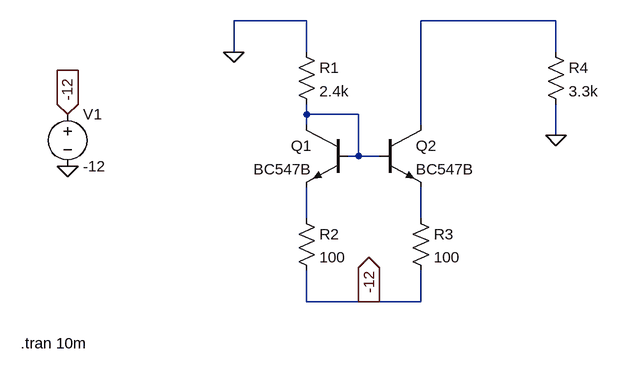
[diagram p0: schematic lab6.1.1a.asc]
lab6.1.1a.asc, the LTspice schematic file:
Version 4
SHEET 1 5668 680
WIRE 112 0 0 0
WIRE 496 0 288 0
WIRE 0 48 0 0
WIRE 112 48 112 0
WIRE 496 48 496 0
WIRE 112 144 112 128
WIRE 192 144 112 144
WIRE 112 160 112 144
WIRE 288 160 288 0
WIRE 496 176 496 128
WIRE 192 208 192 144
WIRE 192 208 176 208
WIRE 224 208 192 208
WIRE 112 304 112 256
WIRE 288 304 288 256
WIRE 112 432 112 384
WIRE 208 432 112 432
WIRE 288 432 288 384
WIRE 288 432 208 432
FLAG 0 48 0
FLAG 496 176 0
FLAG -256 224 0
FLAG -256 144 -12
IOPIN -256 144 In
FLAG 208 432 -12
IOPIN 208 432 Out
SYMBOL res 96 32 R0
SYMATTR InstName R1
SYMATTR Value 2.4k
SYMBOL npn 176 160 M0
SYMATTR InstName Q1
SYMATTR Value BC547B
SYMBOL npn 224 160 R0
SYMATTR InstName Q2
SYMATTR Value BC547B
SYMBOL res 96 288 R0
SYMATTR InstName R2
SYMATTR Value 100
SYMBOL res 272 288 R0
SYMATTR InstName R3
SYMATTR Value 100
SYMBOL res 480 32 R0
SYMATTR InstName R4
SYMATTR Value 3.3k
SYMBOL voltage -256 128 R0
SYMATTR InstName V1
SYMATTR Value -12
TEXT -328 496 Left 2 !.tran 10m

The netlist it stands for:
* lab6.1.1a.asc
R1 0 N002 2.4k
Q1 N002 N002 N003 0 BC547B
Q2 N001 N002 N004 0 BC547B
R2 N003 -12 100
R3 N004 -12 100
R4 N001 0 3.3k
V1 -12 0 -12
.model NPN NPN
.model PNP PNP
.lib standard.bjt
.tran 10m
.backanno
.end